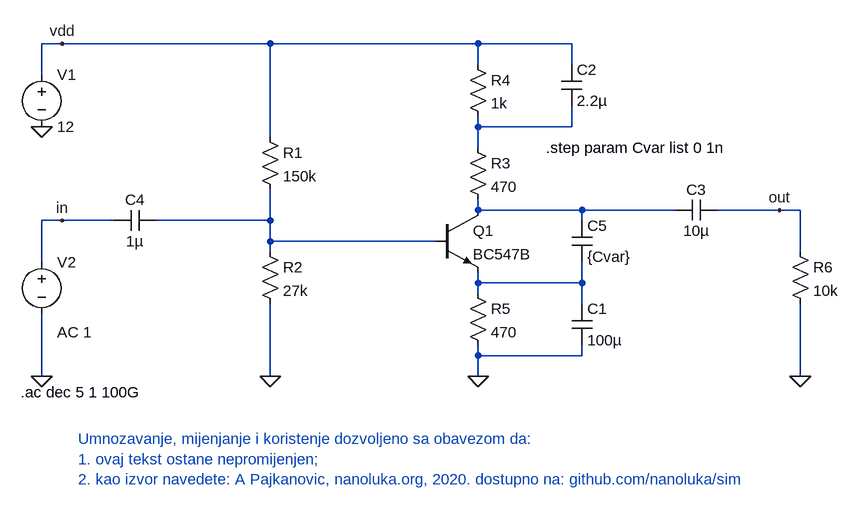
[diagram p0: schematic frekvencijskaKarakteristika.asc]
frekvencijskaKarakteristika.asc, the LTspice schematic file:
Version 4
SHEET 1 928 680
WIRE -272 -96 -304 -96
WIRE 48 -96 -272 -96
WIRE 368 -96 48 -96
WIRE 512 -96 368 -96
WIRE 368 -64 368 -96
WIRE 512 -64 512 -96
WIRE -304 -48 -304 -96
WIRE 368 32 368 16
WIRE 512 32 512 0
WIRE 512 32 368 32
WIRE 48 48 48 -96
WIRE 368 64 368 32
WIRE 368 160 368 144
WIRE 528 160 368 160
WIRE 672 160 528 160
WIRE 832 160 736 160
WIRE 864 160 832 160
WIRE -272 176 -304 176
WIRE -192 176 -272 176
WIRE 48 176 48 128
WIRE 48 176 -128 176
WIRE 528 176 528 160
WIRE 48 208 48 176
WIRE 304 208 48 208
WIRE 48 224 48 208
WIRE 864 224 864 160
WIRE -304 240 -304 176
WIRE 368 272 368 256
WIRE 528 272 528 240
WIRE 528 272 368 272
WIRE 368 288 368 272
WIRE 528 304 528 272
WIRE 368 384 368 368
WIRE 528 384 528 368
WIRE 528 384 368 384
WIRE -304 416 -304 320
WIRE 48 416 48 304
WIRE 368 416 368 384
WIRE 864 416 864 304
FLAG -304 32 0
FLAG 864 416 0
FLAG 368 416 0
FLAG 48 416 0
FLAG -304 416 0
FLAG -272 176 in
FLAG 832 160 out
FLAG -272 -96 vdd
SYMBOL res 32 32 R0
SYMATTR InstName R1
SYMATTR Value 150k
SYMBOL res 32 208 R0
SYMATTR InstName R2
SYMATTR Value 27k
SYMBOL res 352 48 R0
SYMATTR InstName R3
SYMATTR Value 470
SYMBOL res 352 -80 R0
SYMATTR InstName R4
SYMATTR Value 1k
SYMBOL res 352 272 R0
SYMATTR InstName R5
SYMATTR Value 470
SYMBOL cap 512 304 R0
SYMATTR InstName C1
SYMATTR Value 100µ
SYMBOL cap 496 -64 R0
SYMATTR InstName C2
SYMATTR Value 2.2µ
SYMBOL cap 736 144 R90
WINDOW 0 0 32 VBottom 2
WINDOW 3 32 32 VTop 2
SYMATTR InstName C3
SYMATTR Value 10µ
SYMBOL cap -128 160 R90
WINDOW 0 0 32 VBottom 2
WINDOW 3 32 32 VTop 2
SYMATTR InstName C4
SYMATTR Value 1µ
SYMBOL res 848 208 R0
SYMATTR InstName R6
SYMATTR Value 10k
SYMBOL voltage -304 -64 R0
WINDOW 123 0 0 Left 0
WINDOW 39 0 0 Left 0
SYMATTR InstName V1
SYMATTR Value 12
SYMBOL npn 304 160 R0
SYMATTR InstName Q1
SYMATTR Value BC547B
SYMBOL voltage -304 224 R0
WINDOW 123 24 124 Left 2
WINDOW 39 0 0 Left 0
SYMATTR Value2 AC 1
SYMATTR InstName V2
SYMATTR Value ""
SYMBOL cap 512 176 R0
SYMATTR InstName C5
SYMATTR Value {Cvar}
TEXT -336 440 Left 2 !.ac dec 5 1 100G
TEXT 472 64 Left 2 !.step param Cvar list 0 1n
TEXT -248 512 Left 2 ;Umnozavanje, mijenjanje i koristenje dozvoljeno sa obavezom da:\n1. ovaj tekst ostane nepromijenjen;\n2. kao izvor navedete: A Pajkanovic, nanoluka.org, 2020. dostupno na: github.com/nanoluka/sim

The netlist it stands for:
* frekvencijskaKarakteristika.asc
R1 vdd N003 150k
R2 N003 0 27k
R3 N001 N002 470
R4 vdd N001 1k
R5 N004 0 470
C1 N004 0 100µ
C2 vdd N001 2.2µ
C3 out N002 10µ
C4 N003 in 1µ
R6 out 0 10k
V1 vdd 0 12
Q1 N002 N003 N004 0 BC547B
V2 in 0 AC 1
C5 N002 N004 {Cvar}
.model NPN NPN
.model PNP PNP
.lib standard.bjt
.ac dec 5 1 100G
.step param Cvar list 0 1n
* Umnozavanje, mijenjanje i koristenje dozvoljeno sa obavezom da:
* 1. ovaj tekst ostane nepromijenjen;
* 2. kao izvor navedete: A Pajkanovic, nanoluka.org, 2020. dostupno na: github.com/nanoluka/sim
.backanno
.end